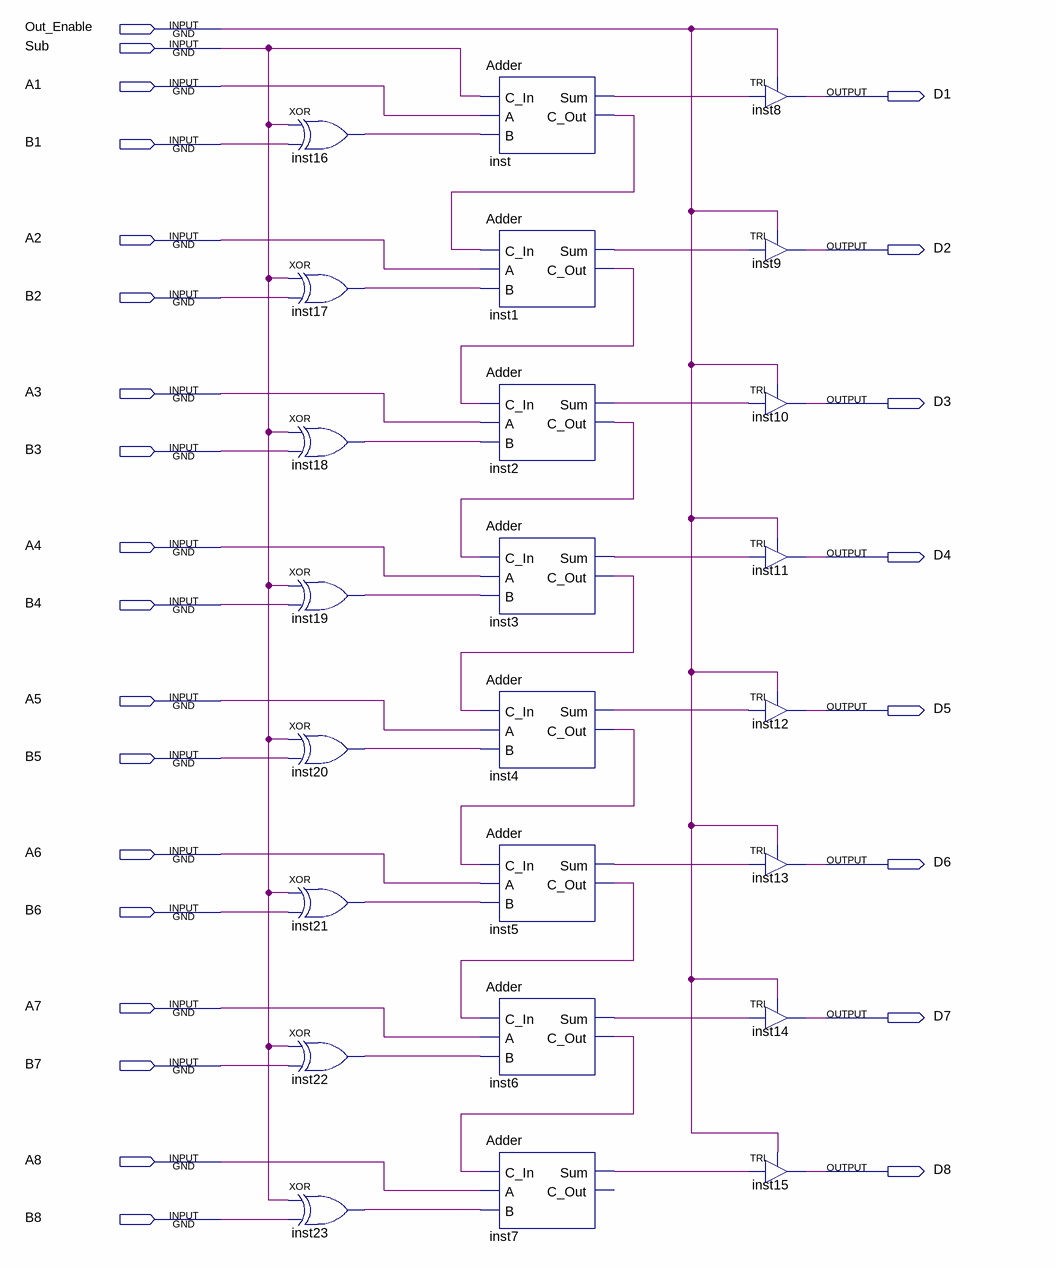
[diagram p0: schematic sheet]
// Quartus schematic ALU.bdf as structural Verilog: 24 symbols, 26 pins
module ALU (
  input  Out_Enable,
  input  Sub,
  input  A1,
  input  B1,
  input  A2,
  input  B2,
  input  A3,
  input  B3,
  input  A4,
  input  B4,
  input  A5,
  input  B5,
  input  A6,
  input  B6,
  input  A7,
  input  B7,
  input  A8,
  input  B8,
  output D1,
  output D2,
  output D3,
  output D4,
  output D5,
  output D6,
  output D7,
  output D8
);

  wire inst1_c_out, inst1_sum, inst2_c_out, inst2_sum, inst3_c_out, inst3_sum, inst4_c_out, inst4_sum,
       inst5_c_out, inst5_sum, inst6_c_out, inst6_sum, inst7_sum, inst16_out, inst17_out, inst18_out,
       inst19_out, inst20_out, inst21_out, inst22_out, inst23_out, inst_c_out, inst_sum;

  xor inst16 (inst16_out, Sub, B1);
  xor inst17 (inst17_out, Sub, B2);
  xor inst18 (inst18_out, Sub, B3);
  xor inst19 (inst19_out, Sub, B4);
  xor inst20 (inst20_out, Sub, B5);
  xor inst21 (inst21_out, Sub, B6);
  xor inst22 (inst22_out, Sub, B7);
  xor inst23 (inst23_out, Sub, B8);
  Adder inst (.C_In(Sub), .A(A1), .B(inst16_out), .Sum(inst_sum), .C_Out(inst_c_out));
  Adder inst1 (.C_In(inst_c_out), .A(A2), .B(inst17_out), .Sum(inst1_sum), .C_Out(inst1_c_out));
  Adder inst2 (.C_In(inst1_c_out), .A(A3), .B(inst18_out), .Sum(inst2_sum), .C_Out(inst2_c_out));
  Adder inst3 (.C_In(inst2_c_out), .A(A4), .B(inst19_out), .Sum(inst3_sum), .C_Out(inst3_c_out));
  Adder inst4 (.C_In(inst3_c_out), .A(A5), .B(inst20_out), .Sum(inst4_sum), .C_Out(inst4_c_out));
  Adder inst5 (.C_In(inst4_c_out), .A(A6), .B(inst21_out), .Sum(inst5_sum), .C_Out(inst5_c_out));
  Adder inst6 (.C_In(inst5_c_out), .A(A7), .B(inst22_out), .Sum(inst6_sum), .C_Out(inst6_c_out));
  Adder inst7 (.C_In(inst6_c_out), .A(A8), .B(inst23_out), .Sum(inst7_sum));  // open: C_Out
  TRI inst8 (.IN(inst_sum), .OE(Out_Enable), .OUT(D1));
  TRI inst9 (.IN(inst1_sum), .OE(Out_Enable), .OUT(D2));
  TRI inst10 (.IN(inst2_sum), .OE(Out_Enable), .OUT(D3));
  TRI inst11 (.IN(inst3_sum), .OE(Out_Enable), .OUT(D4));
  TRI inst12 (.IN(inst4_sum), .OE(Out_Enable), .OUT(D5));
  TRI inst13 (.IN(inst5_sum), .OE(Out_Enable), .OUT(D6));
  TRI inst14 (.IN(inst6_sum), .OE(Out_Enable), .OUT(D7));
  TRI inst15 (.IN(inst7_sum), .OE(Out_Enable), .OUT(D8));
endmodule
